# Altium schematic sheet [05] Ethernet.SchDoc
size A3; Organization: Altium Limited; Address1: L3, 12a Rodborough Rd; Address2: Frenchs Forest; Address3: NSW; Address4: Australia 2086
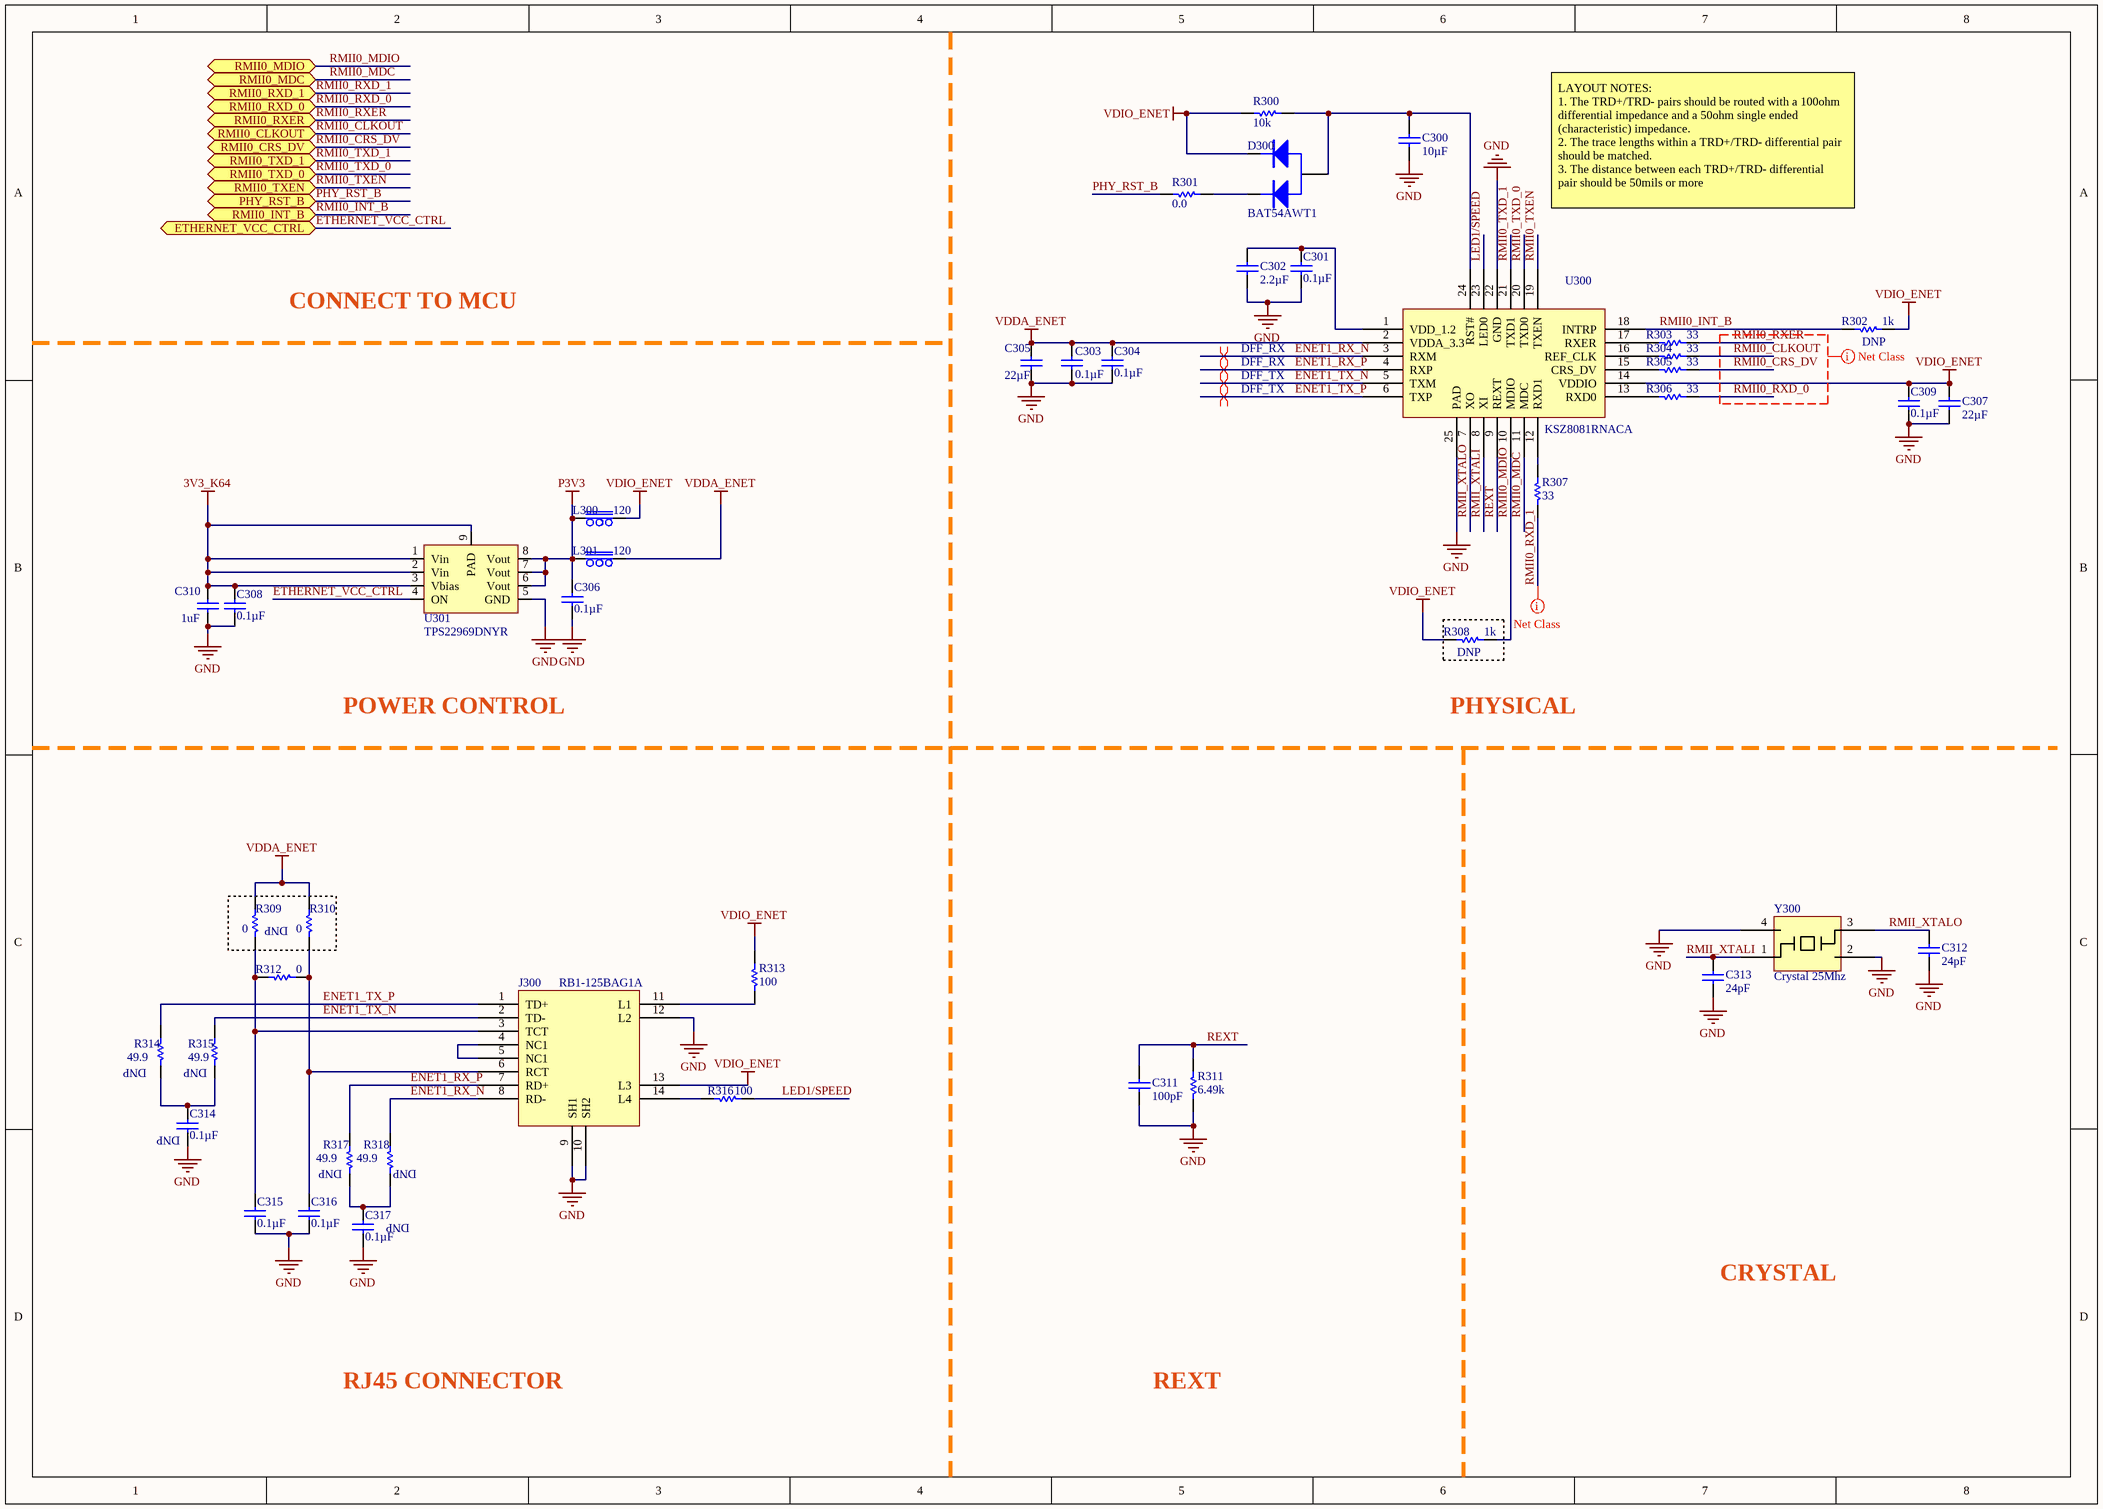
[diagram p0: [05] Ethernet.SchDoc]

## Parts
C300  10µF  [0603C]
C301  0.1µF  [0402C]
C302  2.2µF  [0402C]
C303  0.1µF  [0402C]
C304  0.1µF  [0402C]
C305  22µF  [0603C]
C306  0.1µF  [0402C]
C307  22µF  [0603C]
C308  0.1µF  [0402C]
C309  0.1µF  [0402C]
C310  1uF  [0402C]
C311  100pF  [0603C]
C312  24pF  [0402C]
C313  24pF  [0402C]
C314  0.1µF  [0402C]
C315  0.1µF  [0402C]
C316  0.1µF  [0402C]
C317  0.1µF  [0402C]
D300  BAT54AWT1  [SOT323]
J300  RB1-125BAG1A  [RJ45 Tranfomer]
L300  120  [0805F]
L301  120  [0805F]
R300  10k  [0603R]
R301  0.0  [0603R]
R302  1k  [0402R]
R303  33  [0402R]
R304  33  [0402R]
R305  33  [0402R]
R306  33  [0402R]
R307  33  [0402R]
R308  1k  [0402R]
R309  0  [0402R]
R310  0  [0402R]
R311  6.49k  [0603R]
R312  0  [0402R]
R313  100  [0603R]
R314  49.9  [0603R]
R315  49.9  [0603R]
R316  100  [0603R]
R317  49.9  [0603R]
R318  49.9  [0603R]
U300  KSZ8081RNACA  [QFN24x]
U301  TPS22969DNYR  [WSON8]
Y300  Crystal 25Mhz  [3225 cry]

## Blocks framed on the sheet
DNP: R309 R310

## Ports
ETHERNET_VCC_CTRL (bidir), PHY_RST_B (bidir), RMII0_CLKOUT (bidir), RMII0_CRS_DV (bidir), RMII0_INT_B (bidir), RMII0_MDC (bidir), RMII0_MDIO (bidir), RMII0_RXD_0 (bidir), RMII0_RXD_1 (bidir), RMII0_RXER (bidir), RMII0_TXD_0 (bidir), RMII0_TXD_1 (bidir), RMII0_TXEN (bidir)

## Nets
3V3_K64: C308.2 C310.2 U301.1(Vin) U301.2(Vin) U301.3(Vbias) U301.9(PAD)
GND: C300.1 C301.1 C302.1 C303.1 C304.1 C305.1 C306.1 C307.1 C308.1 C309.1 C310.1 C311.1 C312.1 C313.1 C314.1 C315.1 C316.1 C317.1 J300.9(SH1) J300.10(SH2) J300.12(L2) R311.1 U300.22(GND) U300.25(PAD) U301.5(GND) Y300.2 Y300.4
P3V3: C306.2 L300.1 L301.1 U301.6(Vout) U301.7(Vout) U301.8(Vout)
VDDA_ENET: C303.2 C304.2 C305.2 L301.2 R309.2 R310.2 U300.2(VDDA_3.3)
VDIO_ENET: C307.2 C309.2 D300.1 J300.13(L3) L300.2 R300.1 R302.2 R308.1 R313.2 U300.14(VDDIO)
ENET1_RX_N: J300.8(RD-) R318.2 U300.3(RXM)
ENET1_RX_P: J300.7(RD+) R317.2 U300.4(RXP)
ENET1_TX_N: J300.2(TD-) R315.2 U300.5(TXM)
ENET1_TX_P: J300.1(TD+) R314.2 U300.6(TXP)
ETHERNET_VCC_CTRL: U301.4(ON) ; port ETHERNET_VCC_CTRL
LED1/SPEED: R316.2 U300.23(LED0)
PHY_RST_B: R301.1 ; port PHY_RST_B
REXT: C311.2 R311.2 U300.9(REXT)
RMII0_CLKOUT: R304.2 ; port RMII0_CLKOUT
RMII0_CRS_DV: R305.2 ; port RMII0_CRS_DV
RMII0_INT_B: R302.1 U300.18(INTRP) ; port RMII0_INT_B
RMII0_MDC: U300.11(MDC) ; port RMII0_MDC
RMII0_MDIO: R308.2 U300.10(MDIO) ; port RMII0_MDIO
RMII0_RXD_0: R306.2 ; port RMII0_RXD_0
RMII0_RXD_1: R307.1 ; port RMII0_RXD_1
RMII0_RXER: R303.2 ; port RMII0_RXER
RMII0_TXD_0: U300.20(TXD0) ; port RMII0_TXD_0
RMII0_TXD_1: U300.21(TXD1) ; port RMII0_TXD_1
RMII0_TXEN: U300.19(TXEN) ; port RMII0_TXEN
RMII_XTALI: C313.2 U300.8(XI) Y300.1
RMII_XTALO: C312.2 U300.7(XO) Y300.3
NetC300_2: C300.2 D300.3 R300.2 U300.24(RST#)
NetC301_2: C301.2 C302.2 U300.1(VDD_1.2)
NetC314_2: C314.2 R314.1 R315.1
NetC315_2: C315.2 J300.3(TCT) R309.1 R312.2
NetC316_2: C316.2 J300.6(RCT) R310.1 R312.1
NetC317_2: C317.2 R317.1 R318.1
NetD300_2: D300.2 R301.2
NetJ300_4: J300.4(NC1) J300.5(NC1)
NetJ300_11: J300.11(L1) R313.1
NetJ300_14: J300.14(L4) R316.1
NetR303_1: R303.1 U300.17(RXER)
NetR304_1: R304.1 U300.16(REF_CLK)
NetR305_1: R305.1 U300.15(CRS_DV)
NetR306_1: R306.1 U300.13(RXD0)
NetR307_2: R307.2 U300.12(RXD1)

## Layout directives
differential pair; net class DFF_RX: ENET1_RX_N, ENET1_RX_P
differential pair; net class DFF_TX: ENET1_TX_N, ENET1_TX_P
net class RMII: RMII0_CLKOUT, RMII0_CRS_DV, RMII0_RXD_0, RMII0_RXD_1, RMII0_RXER

## Notes on the sheet
- LAYOUT NOTES:
  1. The TRD+/TRD- pairs should be routed with a 100ohm
  differential impedance and a 50ohm single ended
  (characteristic) impedance.
  2. The trace lengths within a TRD+/TRD- differential pair
  should be matched.
  3. The distance between each TRD+/TRD- differential
  pair should be 50mils or more
- CONNECT TO MCU
- (near R302) DNP
- POWER CONTROL
- PHYSICAL
- (near R308) DNP
- (near R314) DNP
- (near C314) DNP
- (near R315) DNP
- (near R317) DNP
- (near R318) DNP
- DNP
- CRYSTAL
- RJ45 CONNECTOR
- REXT

## Library data of the parts
C300 = cap SMD: CAP CER 10UF 16V X6S 0603; Manufacturer: Taiyo Yuden; Manufacturer Part Number: EMK107BC6106MA-T; Tolerance: ±20%; Supplier 1: Digi-Key; Supplier Part Number 1: 587-4867-1-ND; RoHS: RoHS Compliant; Category: Capacitors; Stock 1: 23688; Pricing 1: 1=0.46, 10=0.32, 100=0.192, 500=0.14402, 1000=0.12162 (USD); Packaging: Cut Tape (CT); Part Status: Active; Voltage - Rated: 16V; Temperature Coefficient: X6S; Operating Temperature: -55°C ~ 105°C; Features: -; Ratings: -; Applications: SMPS Filtering; Failure Rate: -; Mounting Type: Surface Mount, MLCC; Package / Case: 0603 (1608 Metric); Size / Dimension: 0.063" L x 0.031" W (1.60mm x 0.80mm); Height - Seated (Max): -; Thickness (Max): 0.039" (1.00mm); Lead Spacing: -; Lead Style: -; ComponentLink1URL: http://www.yuden.co.jp/productdata/catalog/en/mlcc06_e.pdf; ComponentLink1Description: http://www.yuden.co.jp/productdata/catalog/en/mlcc06_e.pdf
C301 C303 C304 C306 C308 C309 C314-C317 = CAP0.1u0402: CAP CER 0.1UF 10V X7R 0402; Manufacturer: Taiyo Yuden; Manufacturer Part Number: LMK105B7104KVHF; Tolerance: ±10%; Supplier 1: Digi-Key; RoHS: RoHS Compliant; Category: Capacitors; Stock 1: 23930; Pricing 1: 1=0.1, 10=0.05, 100=0.0223, 500=0.01594, 1000=0.01252, 2500=0.01138, 5000=0.01047 (USD); Packaging: Cut Tape (CT); Part Status: Active; Capacitance: 0.1µF; Voltage - Rated: 10V; Temperature Coefficient: X7R; Operating Temperature: -55°C ~ 125°C; Features: -; Ratings: AEC-Q200; Applications: Automotive; Mounting Type: Surface Mount, MLCC; Package / Case: 0402 (1005 Metric); Size / Dimension: 0.039" L x 0.020" W (1.00mm x 0.50mm); Height - Seated (Max): -; Thickness (Max): 0.022" (0.55mm); Lead Spacing: -; Lead Style: -; ComponentLink1URL: http://www.yuden.co.jp/productdata/catalog/en/mlcc_all_hq_e.pdf; ComponentLink1Description: http://www.yuden.co.jp/productdata/catalog/en/mlcc_all_hq_e.pdf; Supplier Part Number 1: 587-3769-1-ND
C302 = cap2.2u0402: CAP CER 2.2UF 16V X5R 0402; Manufacturer: Taiyo Yuden; Manufacturer Part Number: EMK105ABJ225MV-F; Tolerance: ±20%; Supplier 1: Digi-Key; RoHS: RoHS Compliant; Category: Capacitors; Stock 1: 43595; Pricing 1: 1=0.27, 10=0.187, 100=0.1062, 500=0.07498, 1000=0.0656, 2500=0.06248, 5000=0.05779 (USD); Packaging: Cut Tape (CT); Part Status: Active; Capacitance: 2.2µF; Voltage - Rated: 16V; Temperature Coefficient: X5R; Operating Temperature: -55°C ~ 85°C; Features: -; Ratings: -; Applications: General Purpose; Mounting Type: Surface Mount, MLCC; Package / Case: 0402 (1005 Metric); Size / Dimension: 0.039" L x 0.020" W (1.00mm x 0.50mm); Height - Seated (Max): -; Thickness (Max): 0.022" (0.55mm); Lead Spacing: -; Lead Style: -; ComponentLink1URL: http://ds.yuden.co.jp/TYCOMPAS/ut/detail.do?productNo=EMK105ABJ225MV-F&fileName=EMK105ABJ225MV-F_SS&mode=specSheetDownload; ComponentLink1Description: http://ds.yuden.co.jp/TYCOMPAS/ut/detail.do?productNo=EMK105ABJ225MV-F&fileName=EMK105ABJ225MV-F_SS&mode=specSheetDownload; Supplier Part Number 1: 587-3302-1-ND
C305 C307 = cap SMD: CAP CER 22UF 10V X5R 0603; Manufacturer: Taiyo Yuden; Manufacturer Part Number: LMK107BBJ226MA-T; Tolerance: ±20%; Supplier 1: Digi-Key; Supplier Part Number 1: 587-4913-1-ND; RoHS: RoHS Compliant; Category: Capacitors; Stock 1: 11956; Pricing 1: 1=0.49, 10=0.345, 100=0.2271, 500=0.16826, 1000=0.14302 (USD); Packaging: Cut Tape (CT); Part Status: Active; Voltage - Rated: 10V; Temperature Coefficient: X5R; Operating Temperature: -55°C ~ 85°C; Features: -; Ratings: -; Applications: SMPS Filtering; Failure Rate: -; Mounting Type: Surface Mount, MLCC; Package / Case: 0603 (1608 Metric); Size / Dimension: 0.063" L x 0.031" W (1.60mm x 0.80mm); Height - Seated (Max): -; Thickness (Max): 0.039" (1.00mm); Lead Spacing: -; Lead Style: -; ComponentLink1URL: http://ds.yuden.co.jp/TYCOMPAS/ut/detail.do?productNo=LMK107BBJ226MA-T&fileName=LMK107BBJ226MA-T_SS&mode=specSheetDownload; ComponentLink1Description: http://ds.yuden.co.jp/TYCOMPAS/ut/detail.do?productNo=LMK107BBJ226MA-T&fileName=LMK107BBJ226MA-T_SS&mode=specSheetDownload
C310 = cap SMD: CAP CER 1UF 10V X6S 0402; Manufacturer: Taiyo Yuden; Manufacturer Part Number: LMK105C6105KV-F; Tolerance: ±10%; Supplier 1: Digi-Key; Supplier Part Number 1: 587-3409-1-ND; RoHS: RoHS Compliant; Category: Capacitors; Stock 1: 11404; Pricing 1: 1=0.13, 10=0.096, 100=0.0451, 500=0.03164, 1000=0.02619, 2500=0.02438, 5000=0.0223 (USD); Packaging: Cut Tape (CT); Part Status: Active; Voltage - Rated: 10V; Temperature Coefficient: X6S; Operating Temperature: -55°C ~ 105°C; Features: -; Ratings: -; Applications: General Purpose; Mounting Type: Surface Mount, MLCC; Package / Case: 0402 (1005 Metric); Size / Dimension: 0.039" L x 0.020" W (1.00mm x 0.50mm); Height - Seated (Max): -; Thickness (Max): 0.022" (0.55mm); Lead Spacing: -; Lead Style: -; ComponentLink1URL: http://www.yuden.co.jp/productdata/catalog/en/mlcc01_e.pdf; ComponentLink1Description: http://www.yuden.co.jp/productdata/catalog/en/mlcc01_e.pdf
C311 = cap SMD: CAP CER 100PF 250V NP0 0603; Manufacturer: Taiyo Yuden; Manufacturer Part Number: QVS107CG101JCHT; Tolerance: ±5%; Temperature Coefficient: C0G, NP0; Supplier 1: Digikey; Supplier Part Number 1: 587-4439-6-ND; Stock 1: 7748; Pricing 1: 1=0.71, 10=0.598, 50=0.4286, 100=0.3751, 250=0.2947, 500=0.2679, 1000=0.2143 (USD); Category: Capacitors; Family: Ceramic Capacitors; Series: V; Packaging: Tape &amp; Reel (TR); Capacitance: 100pF; Voltage - Rated: 250V; Mounting Type: Surface Mount, MLCC; Operating Temperature: -55°C ~ 125°C; Applications: Automotive; Ratings: -; Package / Case: 0603 (1608 Metric); Size / Dimension: 0.063" L x 0.031" W (1.60mm x 0.80mm); Height - Seated (Max): -; Thickness (Max): 0.031" (0.80mm); Lead Spacing: -; Features: -; Lead Style: -
C312 C313 = cap SMD: CAP CER 24PF 50V NP0 0402; Manufacturer: Taiyo Yuden; Manufacturer Part Number: UMK105CG240JV-F; Tolerance: 5 %; Temperature Coefficient / Code: C0G; Supplier 1: Digikey; Supplier Part Number 1: UMK105CG240JV-F-ND; Stock 1: 0; Pricing 1: 10000=0.0034 (USD); Capacitance: 24 pF; Case Code - in: 0402; Case Code - mm: 1005; Operating Temperature Range: - 55 C to + 125 C; Dimensions: 0.5 mm W x 1 mm L x 0.5 mm H; RoHS: Details; Product: General Type MLCCs; Packaging: Reel; Package / Case: 0402 (1005 metric); Series: M; Termination Style: SMD/SMT; Voltage Rating: 50 V; ComponentLink1URL: http://www.mouser.com/ds/2/396/mlcc02_e-9198.pdf; ComponentLink1Description: http://www.mouser.com/ds/2/396/mlcc02_e-9198.pdf
D300 = diodes barrier: DIODE ARRAY SCHOTTKY 30V SOT323; Manufacturer: ON Semiconductor; Manufacturer Part Number: BAT54AWT1G; Diode Configuration: 1 Pair Common Anode; Current - Average Rectified (Io) (per Diode): 200mA (DC); Voltage - Forward (Vf) (Max) @ If: 800mV @ 100mA; Speed: Small Signal =< 200mA (Io), Any Speed; Current - Reverse Leakage @ Vr: 2µA @ 25V; Supplier 1: Digi-Key; Supplier Part Number 1: BAT54AWT1GOSCT-ND; RoHS: RoHS Compliant; Category: Discrete Semiconductor Products; Stock 1: 0; Pricing 1: 1=0.3, 10=0.248, 100=0.1313, 500=0.08638, 1000=0.05874 (USD); Packaging: Cut Tape (CT); Part Status: Active; Diode Type: Schottky; Operating Temperature - Junction: -55°C ~ 125°C; Mounting Type: Surface Mount; Package / Case: SC-70, SOT-323; Supplier Device Package: SOT-323; ComponentLink1URL: http://www.onsemi.com/pub_link/Collateral/BAT54AWT1-D.PDF; ComponentLink1Description: http://www.onsemi.com/pub_link/Collateral/BAT54AWT1-D.PDF
J300 = RJ45: CONN MAGJACK 1PORT 100 BASE-T; Manufacturer: WIZnet; Number of Ports: 1; LED Color: Green - Yellow; Number of Cores per Jack: 4; Shielding: Shielded, EMI Finger; Tab Direction: Down; Shield Material: Stainless Steel; Other Names: 1278-1011  RB1125BAG1A; Supplier 1: Digikey; Manufacturer Part Number: RB1-125BAG1A; Stock 1: 25601; Pricing 1: 1=2.55, 10=2.448, 25=2.244, 50=2.142, 100=2.04, 250=1.785, 500=1.734, 1000=1.56 (USD); Standard Package: 420; Category: Connectors, Interconnects; Family: Modular Connectors - Jacks With Magnetics; Series: -; Packaging: Bulk; Connector Type: RJ45; Number of Rows: 1; Applications: 10/100 Base-T, AutoMDIX; Mounting Type: Through Hole; Orientation: 90° Angle (Right); Termination: Solder; Height Above Board: 0.525" (13.33mm); Features: Board Lock; Contact Material: Phosphor Bronze; Contact Finish: Gold; Contact Finish Thickness: Flash; Housing Material: Thermoplastic; Operating Temperature: 0°C ~ 70°C; Online Catalog: WIZnet; ComponentLink1URL: https://datasheet.ciiva.com/16480/rb1-125bag1a-16480451.pdf; ComponentLink1Description: https://datasheet.ciiva.com/16480/rb1-125bag1a-16480451.pdf; ComponentLink2URL: https://datasheet.ciiva.com/19455/2132875-19455478.pdf; ComponentLink2Description: https://datasheet.ciiva.com/19455/2132875-19455478.pdf; ComponentLink3URL: https://datasheet.ciiva.com/6930/rb1-125bag1a-approvalsheet-6930969.pdf; ComponentLink3Description: https://datasheet.ciiva.com/6930/rb1-125bag1a-approvalsheet-6930969.pdf; ComponentLink4URL: https://datasheet.ciiva.com/15367/rb1-125bag1a111-00-224696-15367787.pdf; ComponentLink4Description: https://datasheet.ciiva.com/15367/rb1-125bag1a111-00-224696-15367787.pdf; Supplier Part Number 1: 1278-1011-ND
L300 L301 = Ferrite Bead: Manufacturer: MURATA; Manufacturer Part Number: BLM18PG121SN1D; Ferrite Case Style: 0603 [1608 Metric]; Product Range: BLM18; DC Current Rating: 2; DC Resistance Max: 0.05; Impedance Tolerance: 25%; Supplier 1: Newark; RoHS: YES; Stock 1: 28827; Pricing 1: 1=0.039, 50=0.036, 100=0.029, 500=0.026, 1000=0.023, 2500=0.022, 5000=0.02, 10000=0.019 (USD); Automotive Qualifications Standard: -; Packaging: Each; ComponentLink1URL: http://www.farnell.com/datasheets/1740433.pdf; ComponentLink1Description: http://www.farnell.com/datasheets/1740433.pdf; ComponentLink2URL: http://www.farnell.com/datasheets/5148.pdf; ComponentLink2Description: http://www.farnell.com/datasheets/5148.pdf; Supplier Part Number 1: 73M9109
R300 = RES10k0603: RES SMD 10K OHM 1% 1/10W 0603; Manufacturer: Panasonic Electronic Components; Manufacturer Part Number: ERJ-3EKF1002V; Power (Watts): 0.1W, 1/10W; Temperature Coefficient: ±100ppm/°C; Supplier 1: Digi-Key; RoHS: RoHS Compliant; Category: Resistors; Stock 1: 0; Pricing 1: 1=0.1, 10=0.021, 100=0.0087, 1000=0.00389, 2500=0.00338 (USD); Packaging: Digi-Reel®; Part Status: Active; Resistance (Ohms): 10k; Tolerance: ±1%; Composition: Thick Film; Features: Automotive AEC-Q200; Operating Temperature: -55°C ~ 155°C; Package / Case: 0603 (1608 Metric); Supplier Device Package: 0603; Size / Dimension: 0.063" L x 0.031" W (1.60mm x 0.80mm); Height - Seated (Max): 0.022" (0.55mm); Failure Rate: -; ComponentLink1URL: https://industrial.panasonic.com/cdbs/www-data/pdf/RDA0000/AOA0000C298.pdf; ComponentLink1Description: https://industrial.panasonic.com/cdbs/www-data/pdf/RDA0000/AOA0000C298.pdf; Supplier Part Number 1: P10.0KHDKR-ND
R301 = RES00603: RES SMD 0.0OHM JUMPER 1/10W 0603; Manufacturer: Panasonic Electronic Components; Manufacturer Part Number: ERJ-3GEY0R00V; Power (Watts): 0.1W, 1/10W; Supplier 1: Digi-Key; RoHS: RoHS Compliant; Category: Resistors; Stock 1: 8597757; Pricing 1: 1=0.1, 10=0.016, 25=0.0116, 50=0.0088, 100=0.0065, 250=0.00496, 500=0.00396, 1000=0.00292 (USD); Packaging: Cut Tape (CT); Part Status: Active; Resistance (Ohms): 0.0; Tolerance: Jumper; Composition: Thick Film; Features: Automotive AEC-Q200; Temperature Coefficient: -; Operating Temperature: -55°C ~ 155°C; Package / Case: 0603 (1608 Metric); Supplier Device Package: 0603; Size / Dimension: 0.063" L x 0.031" W (1.60mm x 0.80mm); Height - Seated (Max): 0.022" (0.55mm); Failure Rate: -; ComponentLink1URL: http://industrial.panasonic.com/www-cgi/jvcr13pz.cgi?E+PZ+3+AOA0001+ERJ3GEY0R00V+7+WW; ComponentLink1Description: http://industrial.panasonic.com/www-cgi/jvcr13pz.cgi?E+PZ+3+AOA0001+ERJ3GEY0R00V+7+WW; Supplier Part Number 1: P0.0GCT-ND
R302 R308 = RES1k0402: RES SMD 1K OHM 1% 1/10W 0402; Manufacturer: Panasonic Electronic Components; Manufacturer Part Number: ERJ-2RKF1001X; Power (Watts): 0.1W, 1/10W; Temperature Coefficient: ±100ppm/°C; Supplier 1: Digi-Key; RoHS: RoHS Compliant; Category: Resistors; Stock 1: 0; Pricing 1: 1=0.1, 10=0.028, 100=0.0113, 1000=0.00509, 2500=0.00442, 5000=0.00365 (USD); Packaging: Cut Tape (CT); Part Status: Active; Resistance (Ohms): 1k; Tolerance: ±1%; Composition: Thick Film; Features: Automotive AEC-Q200; Operating Temperature: -55°C ~ 155°C; Package / Case: 0402 (1005 Metric); Supplier Device Package: 0402; Size / Dimension: 0.039" L x 0.020" W (1.00mm x 0.50mm); Height - Seated (Max): 0.016" (0.40mm); Failure Rate: -; ComponentLink1URL: https://industrial.panasonic.com/cdbs/www-data/pdf/RDA0000/AOA0000C298.pdf; ComponentLink1Description: https://industrial.panasonic.com/cdbs/www-data/pdf/RDA0000/AOA0000C298.pdf; Supplier Part Number 1: P1.00KLCT-ND
R303-R307 = RES330402: RES SMD 33 OHM 1% 1/10W 0402; Manufacturer: Panasonic Electronic Components; Manufacturer Part Number: ERJ-2RKF33R0X; Power (Watts): 0.1W, 1/10W; Temperature Coefficient: ±100ppm/°C; Supplier 1: Digi-Key; Supplier Part Number 1: P33.0LCT-ND; RoHS: RoHS Compliant; Category: Resistors; Stock 1: 104778; Pricing 1: 1=0.1, 10=0.028, 100=0.0113, 1000=0.00509, 2500=0.00442, 5000=0.00365 (USD); Packaging: Cut Tape (CT); Part Status: Active; Resistance (Ohms): 33; Tolerance: ±1%; Composition: Thick Film; Features: Automotive AEC-Q200; Operating Temperature: -55°C ~ 155°C; Package / Case: 0402 (1005 Metric); Supplier Device Package: 0402; Size / Dimension: 0.039" L x 0.020" W (1.00mm x 0.50mm); Height - Seated (Max): 0.016" (0.40mm); Failure Rate: -; ComponentLink1URL: http://media.digikey.com/pdf/Data%20Sheets/Panasonic%20Electronic%20Components/ERJ%20Series_Precision.pdf; ComponentLink1Description: http://media.digikey.com/pdf/Data%20Sheets/Panasonic%20Electronic%20Components/ERJ%20Series_Precision.pdf
R309 R310 R312 = RES00603: RES SMD 0.0OHM JUMPER 1/10W 0402; Manufacturer: Panasonic Electronic Components; Manufacturer Part Number: ERJ-2GE0R00X; Power (Watts): 0.1W, 1/10W; Supplier 1: Digi-Key; Supplier Part Number 1: P0.0JCT-ND; RoHS: RoHS Compliant; Category: Resistors; Stock 1: 3982454; Pricing 1: 1=0.1, 10=0.016, 25=0.0116, 50=0.0088, 100=0.0065, 250=0.00496, 500=0.00396, 1000=0.00292, 5000=0.00209 (USD); Packaging: Cut Tape (CT); Part Status: Active; Tolerance: Jumper; Composition: Thick Film; Features: Automotive AEC-Q200; Temperature Coefficient: -; Operating Temperature: -55°C ~ 155°C; Package / Case: 0402 (1005 Metric); Supplier Device Package: 0402; Size / Dimension: 0.039" L x 0.020" W (1.00mm x 0.50mm); Height - Seated (Max): 0.016" (0.40mm); Failure Rate: -; ComponentLink1URL: http://industrial.panasonic.com/www-cgi/jvcr13pz.cgi?E+PZ+3+AOA0001+ERJ2GE0R00X+7+WW; ComponentLink1Description: http://industrial.panasonic.com/www-cgi/jvcr13pz.cgi?E+PZ+3+AOA0001+ERJ2GE0R00X+7+WW
R311 = RES1000603: RES SMD 6.49KOHM 0.1% 1/10W 0603; Manufacturer: Panasonic Electronic Components; Manufacturer Part Number: ERA-3AEB6491V; Power (Watts): 0.1W, 1/10W; Temperature Coefficient: ±25ppm/°C; Supplier 1: Digi-Key; Supplier Part Number 1: P6.49KDBCT-ND; RoHS: RoHS Compliant; Category: Resistors; Stock 1: 16504; Pricing 1: 1=0.35, 10=0.3, 100=0.1172, 1000=0.04906, 2500=0.04498 (USD); Packaging: Cut Tape (CT); Part Status: Active; Resistance (Ohms): 6.49k; Tolerance: ±0.1%; Composition: Thin Film; Features: Automotive AEC-Q200; Operating Temperature: -55°C ~ 155°C; Package / Case: 0603 (1608 Metric); Supplier Device Package: 0603; Size / Dimension: 0.063" L x 0.031" W (1.60mm x 0.80mm); Height - Seated (Max): 0.022" (0.55mm); Failure Rate: -; ComponentLink1URL: https://industrial.panasonic.com/cdbs/www-data/pdf/RDM0000/AOA0000C307.pdf; ComponentLink1Description: https://industrial.panasonic.com/cdbs/www-data/pdf/RDM0000/AOA0000C307.pdf
R313 R316 = RES1000603: RES SMD 100 OHM 1% 1/10W 0603; Manufacturer: Panasonic Electronic Components; Manufacturer Part Number: ERJ-3EKF1000V; Power (Watts): 0.1W, 1/10W; Temperature Coefficient: ±100ppm/°C; Supplier 1: Digi-Key; RoHS: RoHS Compliant; Category: Resistors; Stock 1: 648504; Pricing 1: 1=0.1, 10=0.021, 100=0.0087, 1000=0.00389, 2500=0.00338 (USD); Packaging: Cut Tape (CT); Part Status: Active; Resistance (Ohms): 100; Tolerance: ±1%; Composition: Thick Film; Features: Automotive AEC-Q200; Operating Temperature: -55°C ~ 155°C; Package / Case: 0603 (1608 Metric); Supplier Device Package: 0603; Size / Dimension: 0.063" L x 0.031" W (1.60mm x 0.80mm); Height - Seated (Max): 0.022" (0.55mm); Failure Rate: -; ComponentLink1URL: https://industrial.panasonic.com/cdbs/www-data/pdf/RDA0000/AOA0000C298.pdf; ComponentLink1Description: https://industrial.panasonic.com/cdbs/www-data/pdf/RDA0000/AOA0000C298.pdf; Supplier Part Number 1: P100HCT-ND
R314 R315 R317 R318 = Resistor: RES SMD 49.9 OHM 1% 1/10W 0603; Manufacturer: Panasonic Electronic Components; Manufacturer Part Number: ERJ-3EKF49R9V; Power (Watts): 0.1W, 1/10W; Temperature Coefficient: ±100ppm/°C; Supplier 1: Digi-Key; Supplier Part Number 1: P49.9HCT-ND; RoHS: RoHS Compliant; Category: Resistors; Stock 1: 0; Pricing 1: 1=0.1, 10=0.021, 100=0.0087, 1000=0.00389, 2500=0.00338 (USD); Packaging: Cut Tape (CT); Part Status: Active; Resistance (Ohms): 49.9; Tolerance: ±1%; Composition: Thick Film; Features: Automotive AEC-Q200; Operating Temperature: -55°C ~ 155°C; Package / Case: 0603 (1608 Metric); Supplier Device Package: 0603; Size / Dimension: 0.063" L x 0.031" W (1.60mm x 0.80mm); Height - Seated (Max): 0.022" (0.55mm); Failure Rate: -; ComponentLink1URL: http://media.digikey.com/pdf/Data%20Sheets/Panasonic%20Electronic%20Components/ERJ%20Series_Precision.pdf; ComponentLink1Description: http://media.digikey.com/pdf/Data%20Sheets/Panasonic%20Electronic%20Components/ERJ%20Series_Precision.pdf
U300 = KSZ8081RNACA: IC TXRX ETHERNET 24QFN; Manufacturer: Microchip Technology; Manufacturer Part Number: KSZ8081RNACA-TR; Protocol: RMII; Number of Drivers/Receivers: 1/1; Duplex: Full; Voltage - Supply: 1.8V, 2.5V, 3.3V; Supplier 1: Digi-Key; RoHS: RoHS Compliant; Category: Integrated Circuits (ICs); Stock 1: 26739; Pricing 1: 1=1.04, 25=0.8652, 100=0.8613 (USD); Packaging: Cut Tape (CT); Part Status: Active; Type: Transceiver; Data Rate: -; Operating Temperature: 0°C ~ 70°C; Mounting Type: Surface Mount; Package / Case: 24-VFQFN Exposed Pad; Supplier Device Package: 24-QFN (4x4); ComponentLink1URL: http://www.microchip.com/mymicrochip/filehandler.aspx?ddocname=en581592; ComponentLink1Description: http://www.microchip.com/mymicrochip/filehandler.aspx?ddocname=en581592; Supplier Part Number 1: 576-4173-1-ND
U301 = TPS22969: IC LOAD SWITCH 6A 8WSON; Manufacturer: Texas Instruments; Switch Type: General Purpose; Number of Outputs: 1; Ratio - Input:Output: 1:1; Output Configuration: High Side; Output Type: N-Channel; Interface: On/Off; Voltage - Load: 2.5 V ~ 5.5 V; Voltage - Supply (Vcc/Vdd): 0.8 V ~ 5.5 V; Rds On (Typ): 4.4 mOhm; Input Type: Non-Inverting; Supplier 1: Digi-Key; Manufacturer Part Number: TPS22969DNYR; RoHS: RoHS Compliant; Category: Integrated Circuits (ICs); Stock 1: 3303; Pricing 1: 1=1.53, 10=1.368, 100=1.0665, 500=0.882, 1000=0.5625 (USD); Packaging: Cut Tape (CT); Part Status: Active; Current - Output (Max): 6A; Features: Load Discharge, Slew Rate Controlled; Fault Protection: -; Operating Temperature: -40°C ~ 125°C (TJ); Package / Case: 8-WDFN Exposed Pad; Supplier Device Package: 8-WSON (3x3); ComponentLink1URL: http://www.ti.com/lit/ds/symlink/tps22969.pdf; ComponentLink1Description: http://www.ti.com/lit/ds/symlink/tps22969.pdf; Supplier Part Number 1: 296-40721-1-ND
Y300 = Crystal 25Mhz: CRYSTAL 25.0000MHZ 18PF SMD; Manufacturer: CTS-Frequency Controls; Manufacturer Part Number: 403I35D25M00000; Frequency Stability: ±50ppm; Frequency Tolerance: ±30ppm; ESR (Equivalent Series Resistance): 60 Ohm; Operating Mode: Fundamental; Supplier 1: Digi-Key; Supplier Part Number 1: CTX1224CT-ND; RoHS: RoHS Compliant; Category: Crystals, Oscillators, Resonators; Stock 1: 4278; Pricing 1: 1=0.92, 10=0.81, 50=0.7568, 100=0.6688, 500=0.6336, 1000=0.528 (USD); Packaging: Cut Tape (CT); Part Status: Active; Type: MHz Crystal; Frequency: 25MHz; Load Capacitance: 18pF; Operating Temperature: -40°C ~ 85°C; Ratings: -; Mounting Type: Surface Mount; Package / Case: 4-SMD, No Lead; Size / Dimension: 0.126" L x 0.098" W (3.20mm x 2.50mm); Height - Seated (Max): 0.031" (0.80mm); ComponentLink1URL: http://www.ctscorp.com/wp-content/uploads/403.pdf; ComponentLink1Description: http://www.ctscorp.com/wp-content/uploads/403.pdf